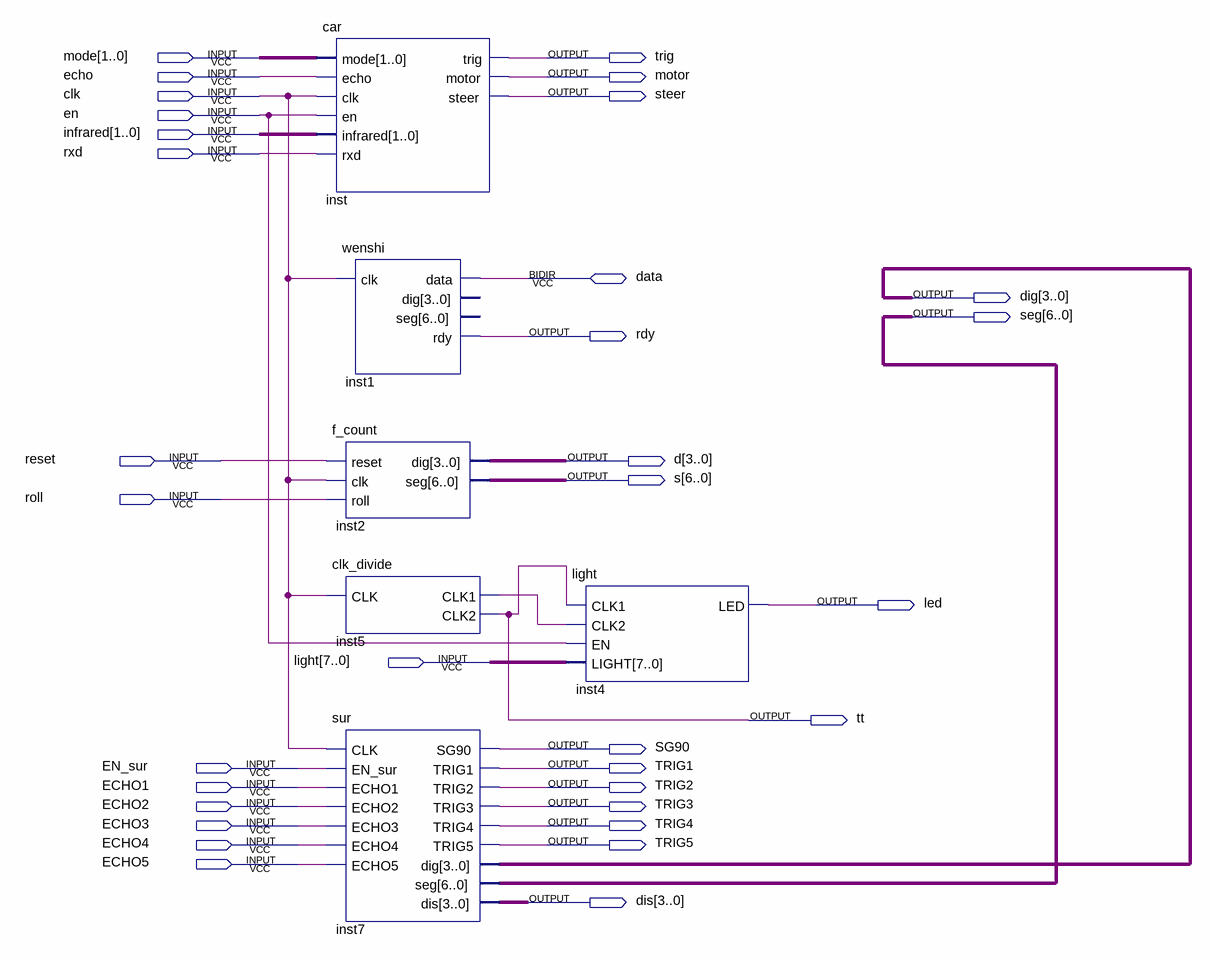
[diagram p0: schematic sheet]
// Quartus schematic autocar.bdf as structural Verilog: 6 symbols, 33 pins
module autocar (
  input  [1:0] mode,
  input  echo,
  input  clk,
  input  en,
  input  [1:0] infrared,
  input  rxd,
  input  reset,
  input  roll,
  input  [7:0] light,
  input  EN_sur,
  input  ECHO1,
  input  ECHO2,
  input  ECHO3,
  input  ECHO4,
  input  ECHO5,
  inout  data,
  output trig,
  output motor,
  output steer,
  output [3:0] dig,
  output [6:0] seg,
  output rdy,
  output [3:0] d,
  output [6:0] s,
  output led,
  output tt,
  output SG90,
  output TRIG1,
  output TRIG2,
  output TRIG3,
  output TRIG4,
  output TRIG5,
  output [3:0] dis
);

  wire inst5_clk1;

  car inst (
    .mode(mode), .echo(echo), .clk(clk), .en(en), .infrared(infrared), .rxd(rxd), .trig(trig), .motor(motor),
    .steer(steer));
  wenshi inst1 (.clk(clk), .rdy(rdy), .data(data));  // open: dig, seg
  f_count inst2 (.reset(reset), .clk(clk), .roll(roll), .dig(d), .seg(s));
  clk_divide inst5 (.CLK(clk), .CLK1(inst5_clk1), .CLK2(tt));
  sur inst7 (
    .CLK(clk), .EN_sur(EN_sur), .ECHO1(ECHO1), .ECHO2(ECHO2), .ECHO3(ECHO3), .ECHO4(ECHO4), .ECHO5(ECHO5),
    .SG90(SG90), .TRIG1(TRIG1), .TRIG2(TRIG2), .TRIG3(TRIG3), .TRIG4(TRIG4), .TRIG5(TRIG5), .dig(dig),
    .seg(seg), .dis(dis));
  light inst4 (.CLK1(tt), .CLK2(inst5_clk1), .EN(en), .LIGHT(light), .LED(led));
endmodule
